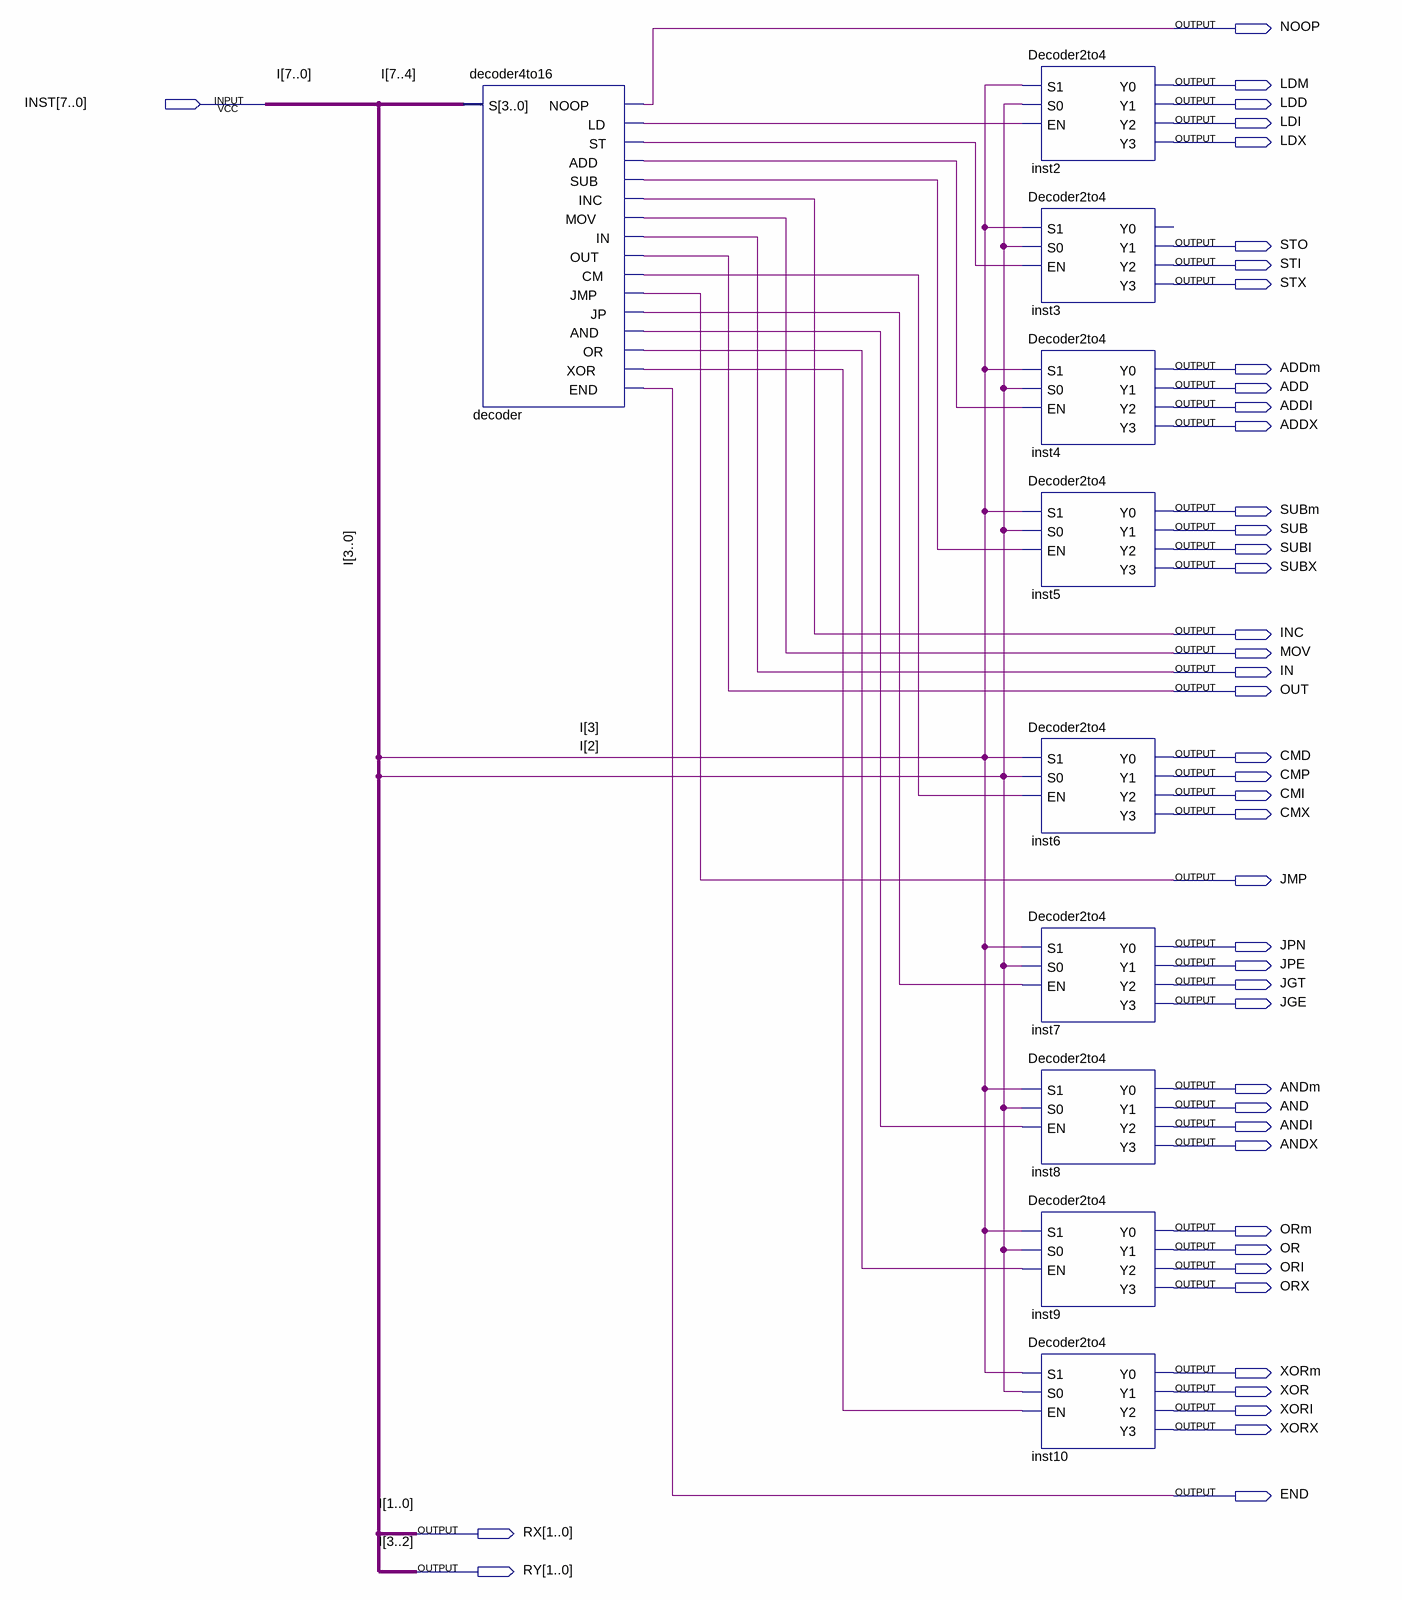
[diagram p0: schematic sheet]
// Quartus schematic Opcode_decoder.bdf as structural Verilog: 10 symbols, 45 pins
module Opcode_decoder (
  input  [7:0] INST,
  output NOOP,
  output LDM,
  output LDD,
  output LDI,
  output LDX,
  output STO,
  output STI,
  output STX,
  output ADDm,
  output ADD,
  output ADDI,
  output ADDX,
  output SUBm,
  output SUB,
  output SUBI,
  output SUBX,
  output INC,
  output MOV,
  output IN,
  output OUT,
  output CMD,
  output CMP,
  output CMI,
  output CMX,
  output JMP,
  output JPN,
  output JPE,
  output JGT,
  output JGE,
  output ANDm,
  output AND,
  output ANDI,
  output ANDX,
  output ORm,
  output OR,
  output ORI,
  output ORX,
  output XORm,
  output XOR,
  output XORI,
  output XORX,
  output END,
  output [1:0] RX,
  output [1:0] RY
);

  wire decoder_add, decoder_and, decoder_cm, decoder_jp, decoder_ld, decoder_or, decoder_st, decoder_sub,
       decoder_xor;

  decoder4to16 decoder (
    .S(INST[7:4]), .NOOP(NOOP), .LD(decoder_ld), .ST(decoder_st), .ADD(decoder_add), .SUB(decoder_sub),
    .INC(INC), .MOV(MOV), .IN(IN), .OUT(OUT), .CM(decoder_cm), .JMP(JMP), .JP(decoder_jp), .AND(decoder_and),
    .OR(decoder_or), .XOR(decoder_xor), .END(END));
  Decoder2to4 inst2 (.S1(INST[3]), .S0(INST[2]), .EN(decoder_ld), .Y0(LDM), .Y1(LDD), .Y2(LDI), .Y3(LDX));
  Decoder2to4 inst3 (.S1(INST[3]), .S0(INST[2]), .EN(decoder_st), .Y1(STO), .Y2(STI), .Y3(STX));  // open: Y0
  Decoder2to4 inst4 (.S1(INST[3]), .S0(INST[2]), .EN(decoder_add), .Y0(ADDm), .Y1(ADD), .Y2(ADDI), .Y3(ADDX));
  Decoder2to4 inst5 (.S1(INST[3]), .S0(INST[2]), .EN(decoder_sub), .Y0(SUBm), .Y1(SUB), .Y2(SUBI), .Y3(SUBX));
  Decoder2to4 inst6 (.S1(INST[3]), .S0(INST[2]), .EN(decoder_cm), .Y0(CMD), .Y1(CMP), .Y2(CMI), .Y3(CMX));
  Decoder2to4 inst7 (.S1(INST[3]), .S0(INST[2]), .EN(decoder_jp), .Y0(JPN), .Y1(JPE), .Y2(JGT), .Y3(JGE));
  Decoder2to4 inst8 (.S1(INST[3]), .S0(INST[2]), .EN(decoder_and), .Y0(ANDm), .Y1(AND), .Y2(ANDI), .Y3(ANDX));
  Decoder2to4 inst9 (.S1(INST[3]), .S0(INST[2]), .EN(decoder_or), .Y0(ORm), .Y1(OR), .Y2(ORI), .Y3(ORX));
  Decoder2to4 inst10 (.S1(INST[3]), .S0(INST[2]), .EN(decoder_xor), .Y0(XORm), .Y1(XOR), .Y2(XORI), .Y3(XORX));

  assign RX = INST[1:0];
  assign RY = INST[3:2];

  // Other names for the same wires on the sheet: I[7:0] = INST
endmodule
